# EAGLE design minimega (EAGLE 6.4)
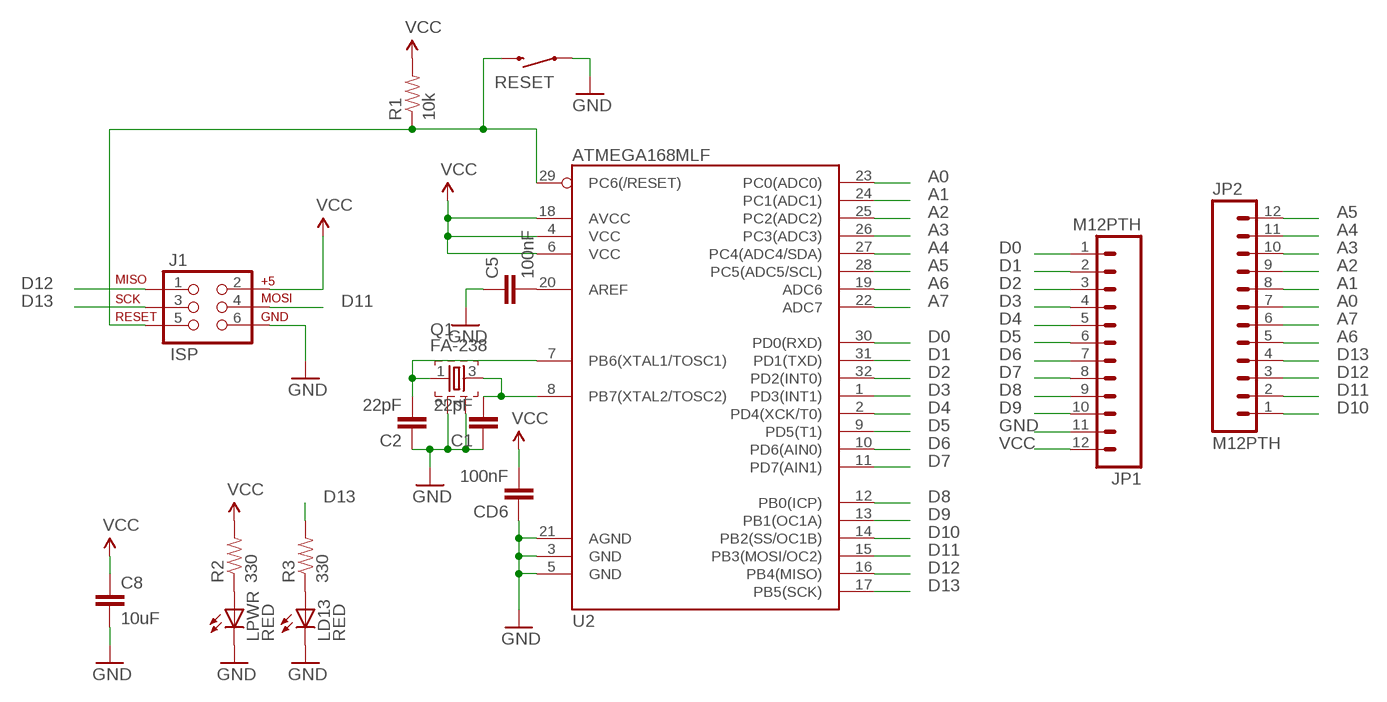
[diagram p0: schematic, sheet 1]

## Parts
C1  22pF  10NF-CER  [0402-CAP]
C2  22pF  10NF-CER  [0402-CAP]
C5  100nF  10NF-CER  [0402-CAP]
C8  10uF  CAP0805  [0805]
CD6  100nF  10NF-CER  [0402-CAP]
J1  ISP  AVR_SPI_PRG_6PTH  [2X3]
JP1  M12PTH  [1X12]
JP2  M12PTH  [1X12]
LD13  RED  LED-RED0603  [LED-0603]
LPWR  RED  LED-RED0603  [LED-0603]
Q1  FA-238  [FA-238]
R1  10k  RESISTOR0603  [0603-RES]
R2  330  RESISTOR0603  [0603-RES]
R3  330  RESISTOR0603  [0603-RES]
RESET  SWITCH-MOMENTARY-2PTH  [TACTILE-PTH]
U2  ATMEGA168MLF  [MLF32]

## Nets
A0: JP2.7 U2.23(PC0(ADC0))
A1: JP2.8 U2.24(PC1(ADC1))
A2: JP2.9 U2.25(PC2(ADC2))
A3: JP2.10 U2.26(PC3(ADC3))
A4: JP2.11 U2.27(PC4(ADC4/SDA))
A5: JP2.12 U2.28(PC5(ADC5/SCL))
A6: JP2.5 U2.19(ADC6)
A7: JP2.6 U2.22(ADC7)
D0: JP1.1 U2.30(PD0(RXD))
D1: JP1.2 U2.31(PD1(TXD))
D2: JP1.3 U2.32(PD2(INT0))
D3: JP1.4 U2.1(PD3(INT1))
D4: JP1.5 U2.2(PD4(XCK/T0))
D5: JP1.6 U2.9(PD5(T1))
D6: JP1.7 U2.10(PD6(AIN0))
D7: JP1.8 U2.11(PD7(AIN1))
D8: JP1.9 U2.12(PB0(ICP))
D9: JP1.10 U2.13(PB1(OC1A))
D10: JP2.1 U2.14(PB2(SS/OC1B))
D11: J1.4 JP2.2 U2.15(PB3(MOSI/OC2))
D12: J1.1 JP2.3 U2.16(PB4(MISO))
D13: J1.3 JP2.4 R3.2 U2.17(PB5(SCK))
GND: C1.1 C2.1 C5.1 C8.2 CD6.1 J1.6 JP1.11 LD13.C LPWR.C Q1.2 Q1.4 RESET.1 U2.3(GND) U2.5(GND) U2.21(AGND)
N$1: LD13.A R3.1
N$2: C1.2 Q1.3 U2.8(PB7(XTAL2/TOSC2))
N$3: C2.2 Q1.1 U2.7(PB6(XTAL1/TOSC1))
N$4: C5.2 U2.20(AREF)
N$24: J1.5 R1.1 RESET.3 U2.29(PC6(/RESET))
N$25: LPWR.A R2.1
VCC: C8.1 CD6.2 J1.2 JP1.12 R1.2 R2.2 U2.4(VCC) U2.6(VCC) U2.18(AVCC)

## Library data of the parts
C1 C2 C5 CD6 = SparkFun-Capacitors:10NF-CER: 10nF/.01uF/10000pF ceramic SMT CAP-00867- 50V 10% (0603); PROD_ID: CAP-00867; VALUE: 10nF
C8 = SparkFun-Capacitors:CAP: Capacitor Standard 0603 ceramic capacitor, and 0.1" leaded capacitor.
J1 = SparkFun-Connectors:AVR_SPI_PRG_6: AVR ISP 6 Pin This is the reduced ISP connector for AVR programming. Common on Arduino. This footprint will take up less PCB space and can be used with a 10-pin to 6-pin adapter such as SKU: BOB-08508
JP1 JP2 = SparkFun-Connectors:M12: Header 12 Standard 12-pin 0.1" header. Use with straight break away headers (SKU : PRT-00116), right angle break away headers (PRT-00553), swiss pins (PRT-00743), machine pins (PRT-00117), and female headers (PRT-00115).
LD13 LPWR = SparkFun-LED:LED-RED: Assorted Red LEDs LilyPad 1206- DIO-09912 1206- DIO-00809 0603- DIO-00819; PROD_ID: DIO-00819
Q1 = kmod:FA-: MHz RANGE CRYSTAL UNIT Source: Epson Toyocom
R1-R3 = SparkFun-Resistors:RESISTOR: Resistor Basic schematic elements and footprints for 0603, 1206, and PTH resistors.
RESET = SparkFun-Electromechanical:SWITCH-MOMENTARY-2: Various NO switches- pushbuttons, reed, etc
U2 = SparkFun-DigitalIC:ATMEGA168: Atmel 32-pin 8-bit micro, 16k flash.

## Board
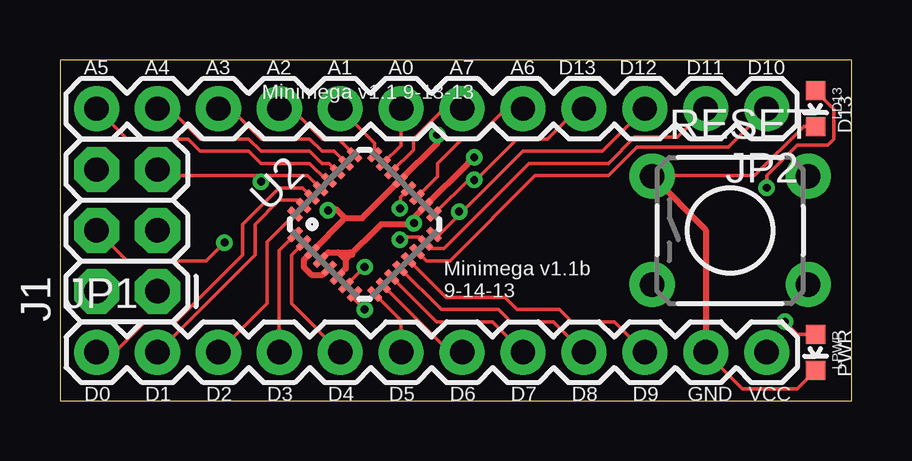
[diagram p1: board, top side]
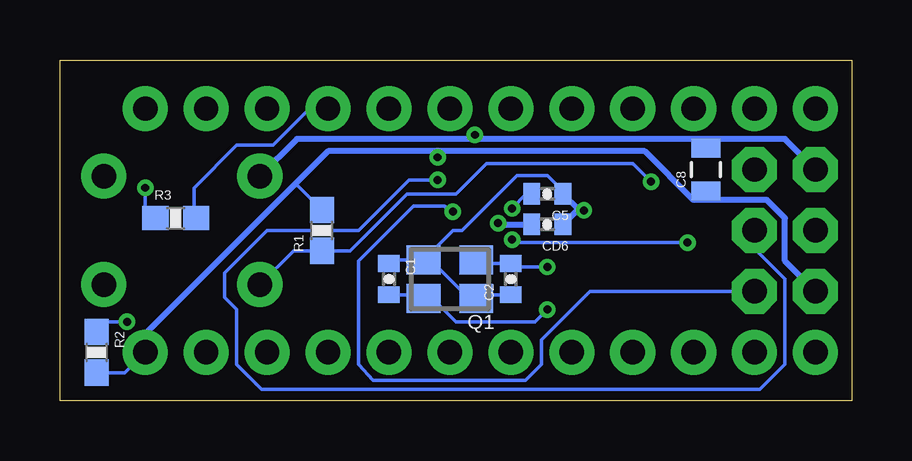
[diagram p2: board, bottom side, seen from below]

Size 33.02 x 14.22 mm. Coordinates in mm from the lower left corner, seen from the top.
Outline: 0,0 33.02,0 33.02,14.22 0,14.21 0,0
Copper layers (1*16): Top 0.0356mm / dielectric 1.5011mm / Bottom 0.0356mm
Design rules "OSHPark_mine": minimum track width 6mil, minimum drill 13mil, track to track 6mil, track to pad 6mil, pad to pad 6mil, via to via 6mil, smd to smd 6mil, copper to edge 15mil, drill to drill 6mil, minimum pad ring 7mil, minimum via ring 7mil, stop-mask expansion 2mil, vias tented up to drill 13mil, thermal gap 10mil

### Footprints (pad centres in the part's own frame; a part is rotated, then mirrored left to right if it is on the bottom)
0402-CAP = smd 0.7 x 0.9: 1 -0.65,0; 2 0.65,0
0805 = smd 0.8 x 1.2: 1 -0.9,0; 2 0.9,0
2X3 = drill 1.016 pad 1.88 octagon: 1 0,0; 2 0,2.54; 3 2.54,0; 4 2.54,2.54; 5 5.08,0; 6 5.08,2.54
1X12 = drill 1.016 pad 1.88: 1 0,0; 2 2.54,0; 3 5.08,0; 4 7.62,0; 5 10.16,0; 6 12.7,0; 7 15.24,0; 8 17.78,0; 9 20.32,0; 10 22.86,0; 11 25.4,0; 12 27.94,0
LED-0603 = smd 0.8 x 0.8: A 0,-0.75; C 0,0.75
FA-238 = smd 1.4 x 1.2: 1 -1.1,-0.8; 2 1.1,-0.8; 3 1.1,0.8; 4 -1.1,0.8
0603-RES = smd 1.1 x 1: 1 -0.85,0; 2 0.85,0
TACTILE-PTH = drill 1.016 pad 1.88: 1 -3.251,2.261; 2 3.251,2.261; 3 -3.251,-2.261; 4 3.251,-2.261
MLF32 = smd 0.7 x 0.3: 1 -2.35,1.75; 2 -2.35,1.25; 3 -2.35,0.75; 4 -2.35,0.25; 5 -2.35,-0.25; 6 -2.35,-0.75; 7 -2.35,-1.25; 8 -2.35,-1.75; 17 2.35,-1.75; 18 2.35,-1.25; 19 2.35,-0.75; 20 2.35,-0.25; 21 2.35,0.25; 22 2.35,0.75; 23 2.35,1.25; 24 2.35,1.75 | smd 0.3 x 0.7: 9 -1.75,-2.35; 10 -1.25,-2.35; 11 -0.75,-2.35; 12 -0.25,-2.35; 13 0.25,-2.35; 14 0.75,-2.35; 15 1.25,-2.35; 16 1.75,-2.35; 25 1.75,2.35; 26 1.25,2.35; 27 0.75,2.35; 28 0.25,2.35; 29 -0.25,2.35; 30 -0.75,2.35; 31 -1.25,2.35; 32 -1.75,2.35

### Placement (x,y rotation side)
C1  19.3,5.08 270 bottom
C2  14.22,5.08 90 bottom
C5  12.7,8.64 180 bottom
C8  6.1,9.65 90 bottom
CD6  12.7,7.37 180 bottom
J1  4.06,4.57 90 top
JP1  1.52,2.03 0 top
JP2  29.46,12.19 180 top
LD13  31.5,12.19 180 top
LPWR  31.5,2.03 180 top
Q1  16.76,5.08 180 bottom
R1  22.1,7.11 90 bottom
R2  31.5,2.03 270 bottom
R3  28.19,7.62 0 bottom
RESET  27.94,7.11 0 top
U2  12.7,7.37 45 top

### Tracks (layer width: path | path; a pad name or v marks a point on that pad's centre or on a via)
A0
  Top 0.152: U2.23 14.22,10.66 JP2.7
A1
  Top 0.152: U2.24 13.12,10.75 JP2.8
A2
  Top 0.152: U2.25 11.62,10.92 10.92,10.92 9.65,12.19 JP2.9
A3
  Top 0.152: U2.26 11.42,10.41 10.92,10.41 10.41,10.92 8.38,10.92 7.11,12.19 JP2.10
A4
  Top 0.152: U2.27 11.22,9.91 10.92,9.91 10.41,10.41 8.38,10.41 7.87,10.92 5.84,10.92 4.57,12.19 JP2.11
A5
  Top 0.152: JP2.12 2.79,10.92 5.33,10.92 5.84,10.41 7.87,10.41 8.38,9.91 10.41,9.91 11.12,9.2 U2.28
A6
  Top 0.152: JP2.5 18.59,12.19 17.32,10.92 16.76,10.92 15.75,9.91 15.75,9.35 U2.19
A7
  Top 0.152: JP2.6 16,12.19 14.73,10.92 14.73,10.46 U2.22
D0
  Top 0.152: U2.30 10.12,8.89 9.14,8.89 7.62,7.37 7.62,6.1 4.83,3.3 3.56,3.3 2.29,2.03 JP1.1
D1
  Top 0.152: JP1.2 8.13,6.1 8.13,7.37 9.14,8.38 9.92,8.38 U2.31
D2
  Top 0.152: JP1.3 8.64,4.06 8.64,6.62 U2.32
D3
  Top 0.152: JP1.4 9.14,6.29 U2.1
D4
  Top 0.152: JP1.5 9.65,4.06 9.65,6.09 U2.2
D5
  Top 0.152: U2.9 14.22,3.37 JP1.6
D6
  Top 0.152: U2.10 16.27,2.03 JP1.7
D7
  Top 0.152: U2.11 15.7,3.3 18.03,3.3 JP1.8
D8
  Top 0.152: U2.12 15.9,3.81 18.29,3.81 18.8,3.3 20.57,3.3 JP1.9
D9
  Top 0.152: U2.13 16.1,4.32 18.54,4.32 19.05,3.81 20.83,3.81 21.34,3.3 23.11,3.3 JP1.10
D10
  Top 0.152: JP2.1 27.86,10.59 24.05,10.59 22.86,9.4 19.81,9.4 16.26,5.84 15.29,5.84 U2.14
D11  (via drill 0.33)
  Top 0.152: JP2.2 25.73,11 23.95,11 22.86,9.91 19.56,9.91 16,6.35 15.48,6.35 U2.15 14.98,6.83 14.48,6.83 v14.17,6.73 | v6.86,6.6 6.1,5.84 2.79,5.84 J1.4
  Bottom 0.152: v14.17,6.73 14.05,6.6 v6.86,6.6
D12  (via drill 0.33)
  Top 0.152: JP2.3 22.61,10.41 19.3,10.41 16.64,7.75 | 16.64,7.75 15.83,6.94 U2.16 | v16.64,7.9 16.64,7.75
  Bottom 0.152: J1.1 10.92,4.57 12.95,2.54 12.95,1.52 13.61,0.86 19.96,0.86 20.57,1.52 20.57,5.84 18.29,8.13 17.02,8.13 v16.64,7.9
D13  (via drill 0.33)
  Top 0.152: JP2.4 21.59,12.19 20.32,10.92 19.05,10.92 17.53,9.4 17.21,9.4 17.11,9.3 | U2.17 17.11,9.3 | v17.27,9.22 17.19,9.3 17.11,9.3
  Bottom 0.152: JP2.4 22.61,12.19 24.13,10.67 25.65,10.67 27.43,8.89 27.43,7.71 R3.2 | J1.3 4.06,6.35 2.79,5.08 2.79,1.52 3.83,0.48 24.61,0.48 25.65,1.52 25.65,3.81 26.16,4.32 26.16,5.33 24.38,7.11 20.57,7.11 18.47,9.22 v17.27,9.22
GND  (via drill 0.33)
  Top 0.152: LPWR.C 30.73,0.51 28.45,0.51 JP1.11 | RESET.1 24.71,9.4 28.96,9.4 31,11.44 LD13.C
  Top 0.254: U2.5 10.95,5.26 10.49,5.26 10.16,5.59 10.16,5.89 U2.3 11.89,7.62 | 11.89,7.62 12.6,7.62 U2.21 15.72,10.74 v15.72,11.1 | 11.89,7.62 11.51,8 v11.18,7.95 | RESET.1 26.92,7.14 JP1.11
  Bottom 0.152: C1.1 19.15,5.88 Q1.2 | C2.1 15.51,4.43 Q1.4 15.96,4.28 17.56,5.88 Q1.2 | C8.2 6.1,10.92 | Q1.2 16.63,7.11 16.26,7.11 13.97,9.4 12.7,9.4 12.05,8.75 C5.1
  Bottom 0.254: 11.41,8 C5.1 | v11.18,7.95 11.41,8 | 11.41,8 CD6.1 | J1.6 2.79,10.92 6.1,10.92 16,10.92 | 16,10.92 23.14,10.92 RESET.1 | v15.72,11.1 15.82,11.1 16,10.92
N$1  (via drill 0.33)
  Top 0.152: v29.46,8.89 29.46,9.4 30.73,10.67 32,10.67 32.26,10.92 32.26,12.18 LD13.A
  Bottom 0.152: v29.46,8.89 29.46,8.04 R3.1
N$2  (via drill 0.33)
  Top 0.152: U2.8 12.28,4.23 v12.7,3.81
  Bottom 0.152: C1.2 18.01,4.43 Q1.3 17.49,4.28 16.51,3.3 13.21,3.3 v12.7,3.81
N$3  (via drill 0.33)
  Top 0.152: U2.7 11.93,4.82 v12.7,5.59
  Bottom 0.152: Q1.1 15.51,5.73 C2.2 14.08,5.59 v12.7,5.59
N$4  (via drill 0.33)
  Top 0.152: U2.20 14.2,8.51 v14.17,8.03
  Bottom 0.152: C5.2 13.59,8.64 v14.17,8.03
N$24  (via drill 0.33)
  Top 0.152: U2.29 10.31,9.4 8.38,9.4 | 8.38,9.4 4.32,9.4 J1.5 | v8.38,9.14 8.38,9.4
  Bottom 0.152: RESET.3 23.28,6.26 R1.1 20.92,6.26 18.54,8.64 16.51,8.64 15.24,9.91 9.14,9.91 v8.38,9.14
N$25  (via drill 0.33)
  Top 0.152: v30.23,3.3 30.75,2.78 LPWR.A
  Bottom 0.152: R2.1 31.08,3.3 v30.23,3.3
VCC  (via drill 0.33)
  Top 0.254: U2.4 11.18,6.2 11.61,6.2 | 11.61,6.2 11.91,5.89 | 11.91,5.89 11.91,5.52 U2.6 | 14.53,7.42 U2.18 17.01,9.91 v17.27,10.16 | 11.91,5.89 13.39,7.37 14.48,7.37 14.53,7.42 | 11.61,6.2 12.09,6.2 12.19,6.1 | v14.76,7.42 14.53,7.42
  Bottom 0.152: R2.2 30.31,1.18 JP1.12 | R1.2 23.15,9.02 23.24,9.02 | C8.1 6.23,8.75 6.6,8.38
  Bottom 0.254: J1.2 2.79,5.84 2.79,7.62 3.56,8.38 6.6,8.38 8.64,10.41 17.27,10.41 | 17.27,10.41 21.84,10.41 23.24,9.02 29.46,2.79 JP1.12 | v17.27,10.16 17.27,10.41 | v14.76,7.42 14.71,7.37 CD6.2

### Text on the board
tPlace: A5 | A4 | A3 | A2 | A1 | A0 | A7 | A6 | D13 | D12 | D11 | D10 | Minimega v1.1 9-13-13 | D13 | Minimega v1.1b / 9-14-13 | PWR | D0 | D1 | D2 | D3 | D4 | D5 | D6 | D7 | D8 | D9 | GND | VCC